# EAGLE design tut1 (EAGLE 6.5.0)
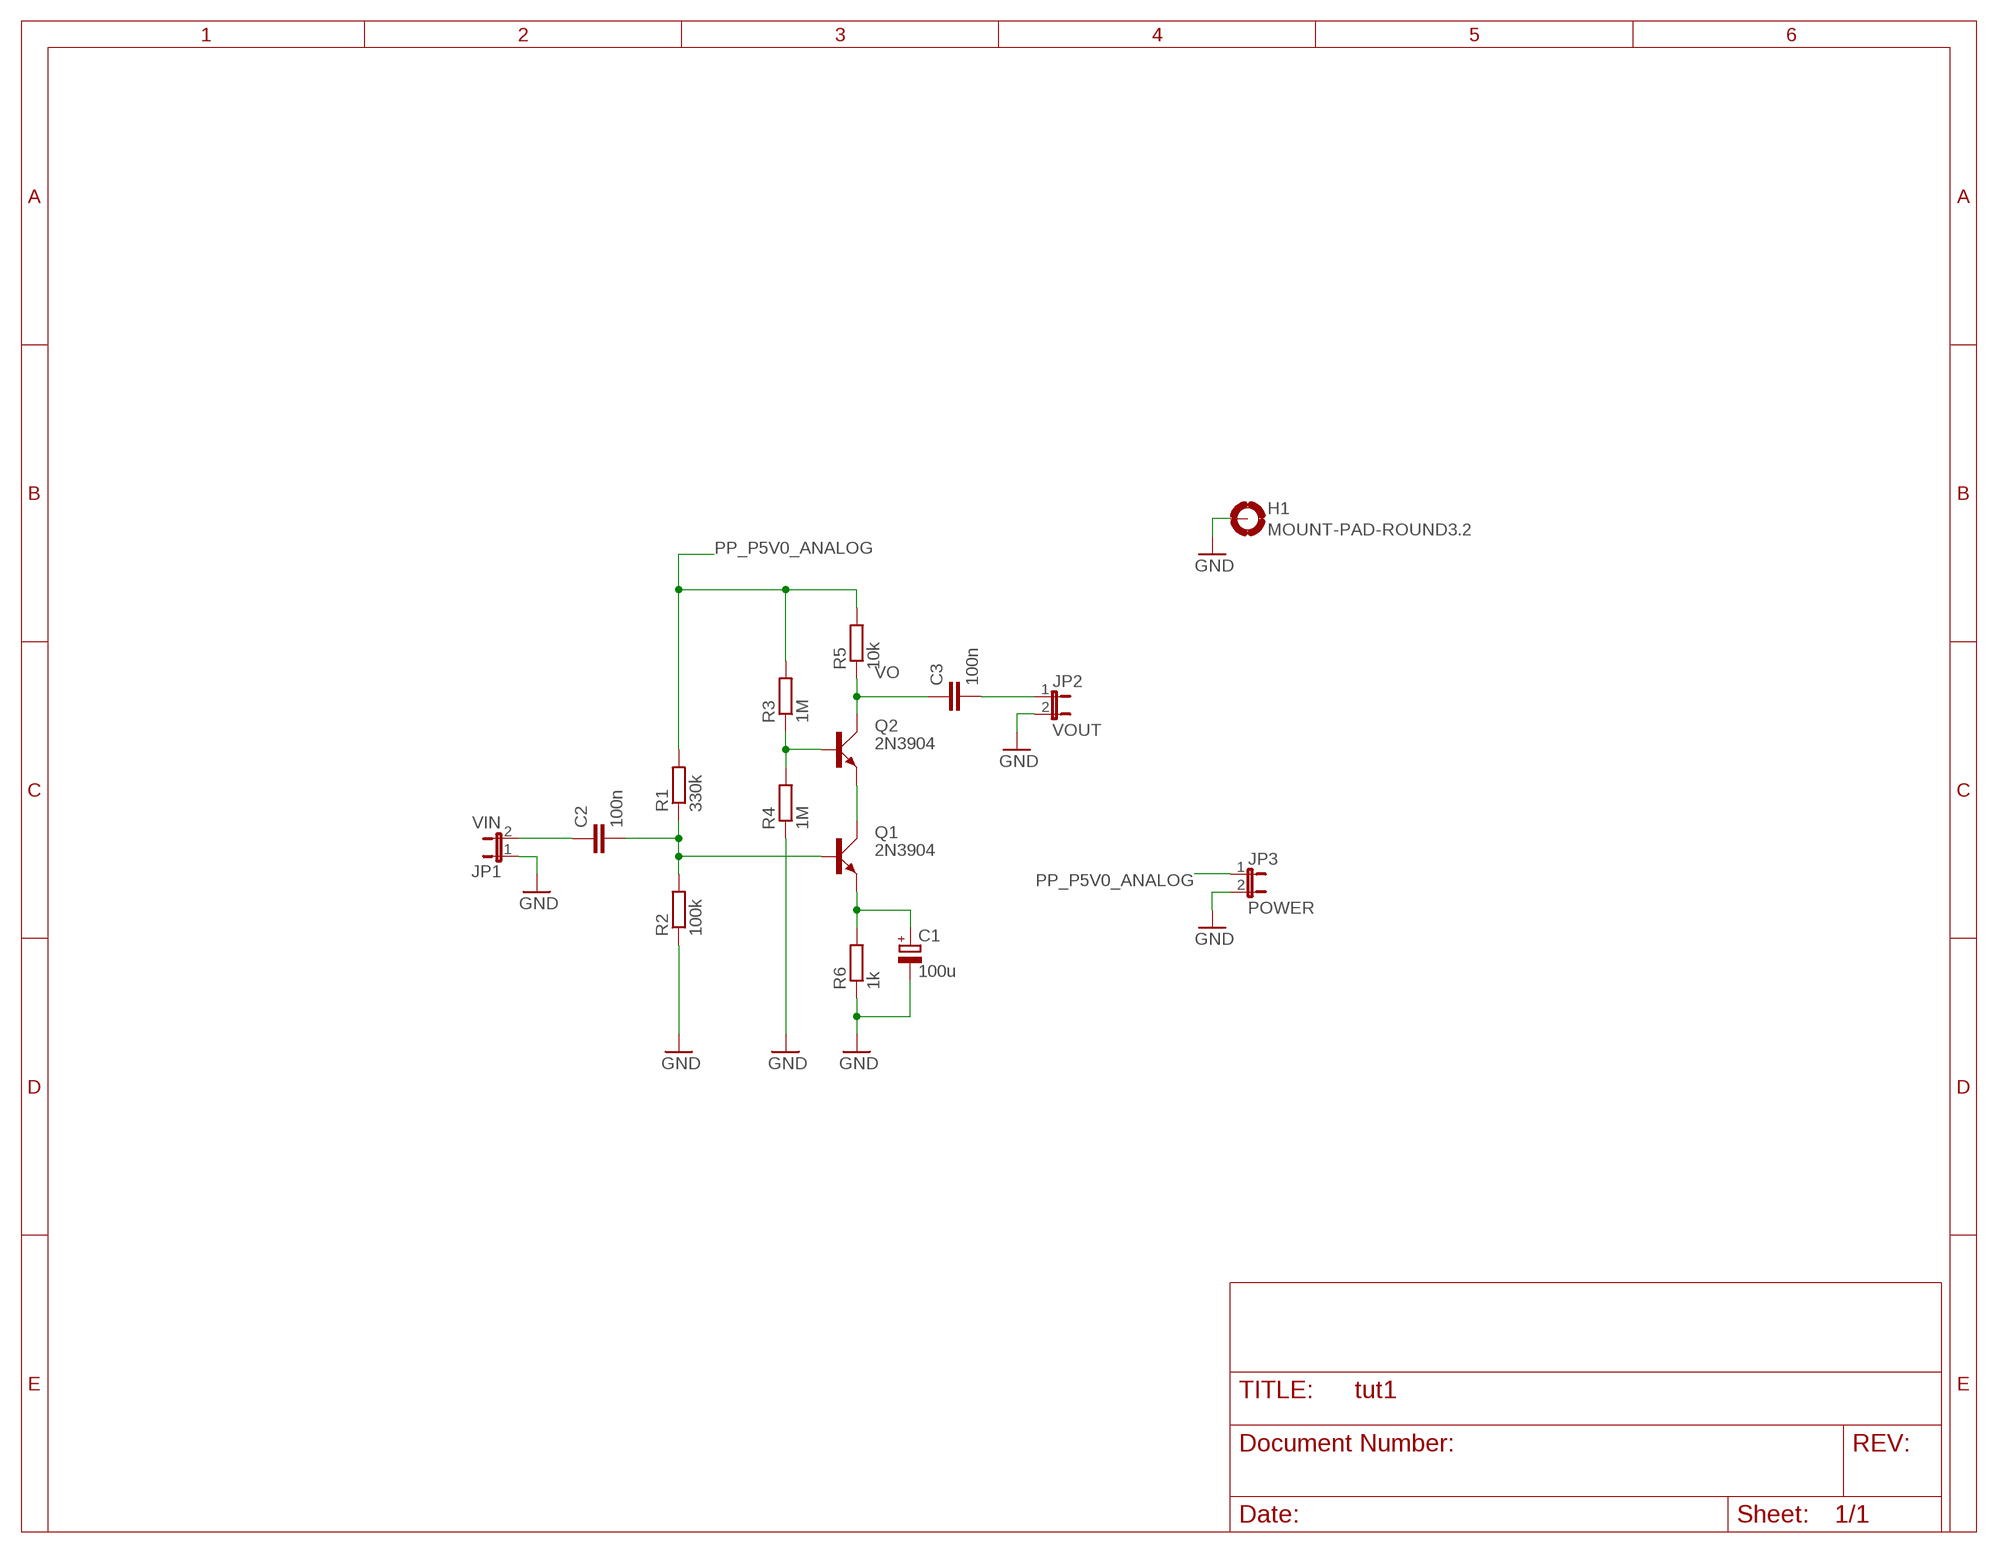
[diagram p0: schematic, sheet 1]

## Parts
C1  100u  CPOL-EUE5-10.5  [E5-10,5]
C2  100n  C-EU050-025X075  [C050-025X075]
C3  100n  C-EU050-025X075  [C050-025X075]
H1  MOUNT-PAD-ROUND3.2  [3,2-PAD]
JP1  VIN  JP1E  [JP1]
JP2  VOUT  JP1E  [JP1]
JP3  POWER  JP1E  [JP1]
Q1  2N3904  [TO92D]
Q2  2N3904  [TO92D]
R1  330k  R-EU_0207/10  [0207/10]
R2  100k  R-EU_0207/10  [0207/10]
R3  1M  R-EU_0207/10  [0207/10]
R4  1M  R-EU_0207/10  [0207/10]
R5  10k  R-EU_0207/10  [0207/10]
R6  1k  R-EU_0207/10  [0207/10]

## Nets
GND: C1.- H1.B3,2(MOUNT) JP1.1 JP2.2 JP3.2 R2.1 R4.1 R6.1
N$1: Q1.C Q2.E
N$2: C1.+ Q1.E R6.2
N$4: Q2.B R3.1 R4.2
N$6: C2.2 Q1.B R1.1 R2.2
N$12: C2.1 JP1.2
N$13: C3.2 JP2.1
PP_P5V0_ANALOG: JP3.1 R1.2 R3.2 R5.2
VO: C3.1 Q2.C R5.1

## Library data of the parts
C1 = rcl:CPOL-EU: POLARIZED CAPACITOR, European symbol
C2 C3 = rcl:C-EU: CAPACITOR, European symbol
H1 = holes:MOUNT-PAD-ROUND: MOUNTING PAD, round
JP1-JP3 = jumper:JP1E: JUMPER
Q1 Q2 = transistor-small-signal:2N3904: NPN TRANSISTOR
R1-R6 = rcl:R-EU_: RESISTOR, European symbol

## Net classes
0 default: width 0.813 mm

## Board
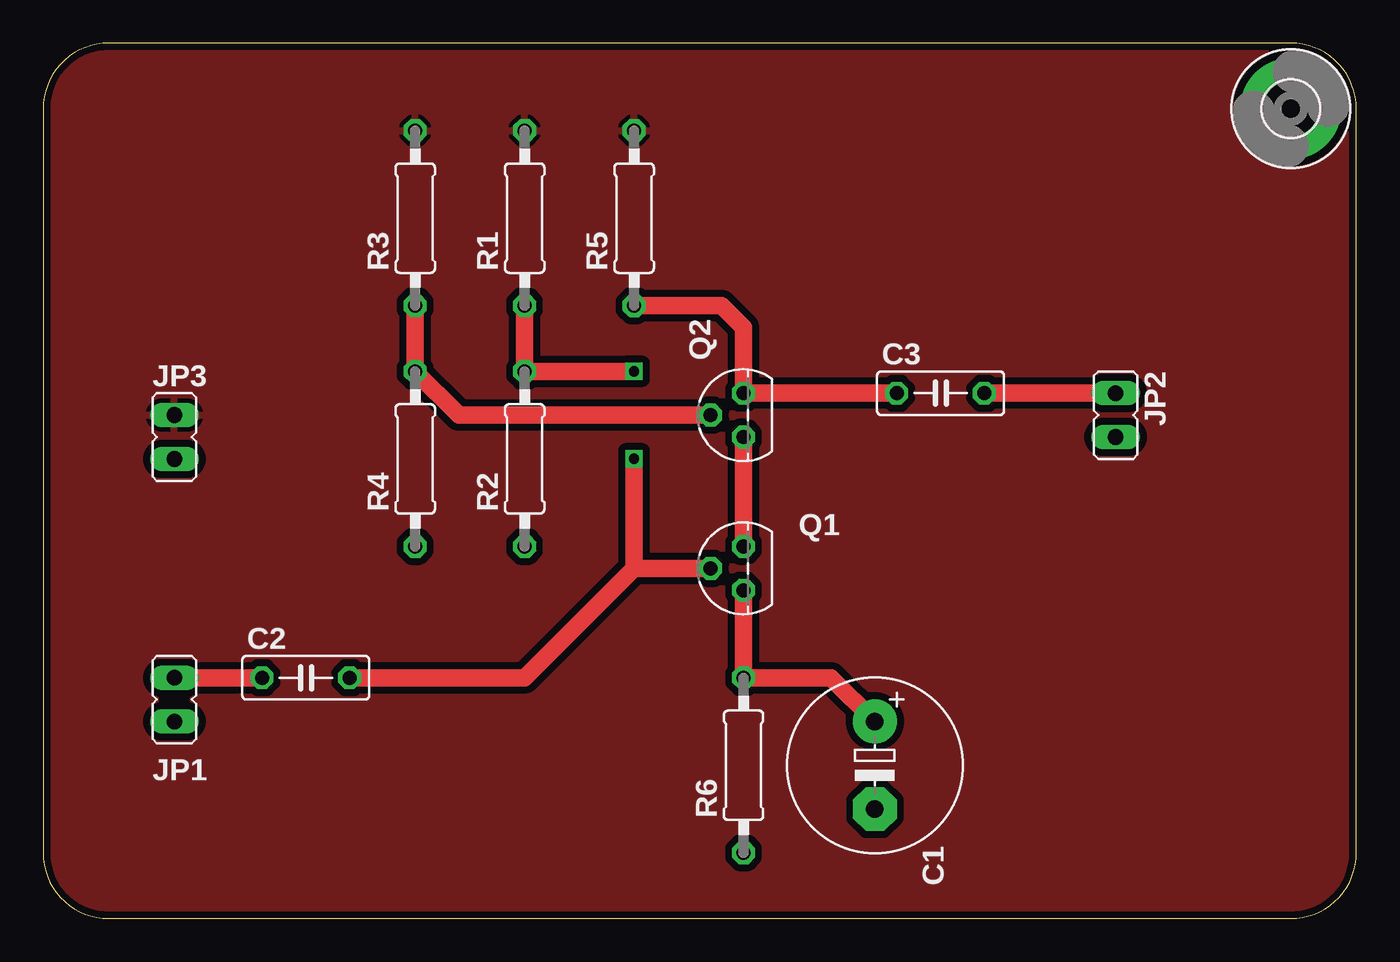
[diagram p1: board, top side]
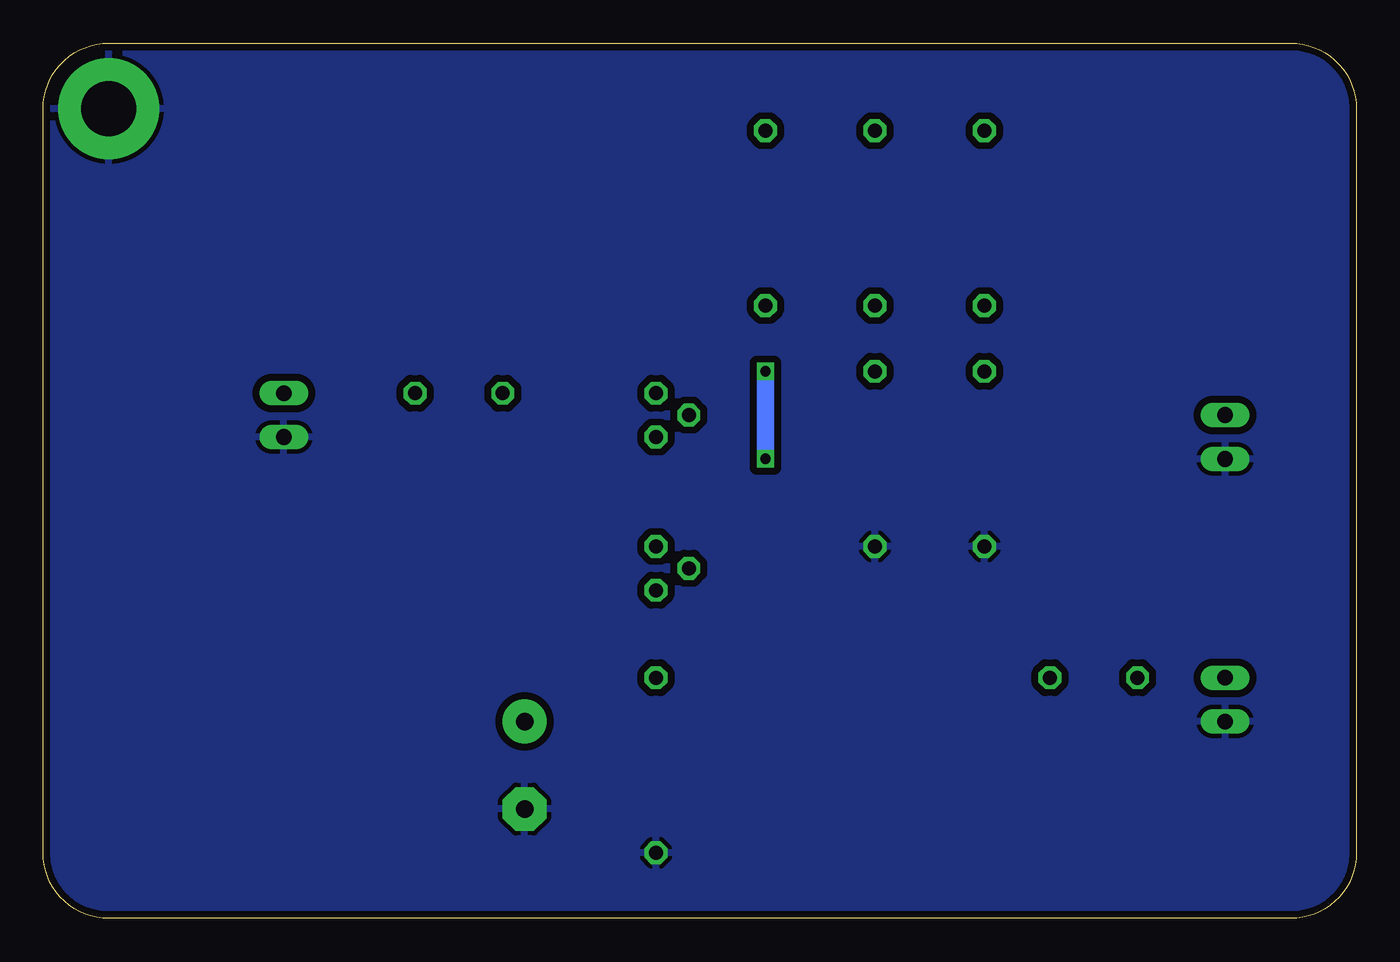
[diagram p2: board, bottom side, seen from below]

Size 76.2 x 50.8 mm. Coordinates in mm from the lower left corner, seen from the top.
Outline: 0,46.99 0,3.81 arc90 3.81,0 72.39,0 arc90 76.2,3.81 76.2,46.99 arc90 72.39,50.8 3.81,50.8 arc90 0,46.99
Copper layers (1*16): Top 0.035mm / dielectric 1.5mm / Bottom 0.035mm
Design rules "default *": minimum track width 16mil, minimum drill 24mil, track to track 16mil, track to pad 16mil, pad to pad 16mil, via to via 16mil, smd to smd 16mil, copper to edge 16mil, drill to drill 8mil, minimum pad ring 10mil, minimum via ring 8mil, stop-mask expansion 4mil, vias tented up to drill 0mil, thermal gap 10mil

### Footprints (pad centres in the part's own frame; a part is rotated, then mirrored left to right if it is on the bottom)
E5-10,5 = drill 1.016 pad 2.54: + -2.54,0 | drill 1.016 pad 2.54 octagon: - 2.54,0
C050-025X075 = drill 0.813 octagon: 1 -2.54,0; 2 2.54,0
3,2-PAD = drill 3.2 pad 5.842: B3,2 0,0
JP1 = drill 0.914 long: 1 0,-1.27; 2 0,1.27
TO92D = drill 0.813 octagon: B 0,1.905; C 1.27,0; E -1.27,0
0207/10 = drill 0.813 octagon: 1 -5.08,0; 2 5.08,0

### Placement (x,y rotation side)
C1  48.26,8.89 270 top
C2  15.24,13.97 0 top
C3  52.07,30.48 0 top
H1  72.39,46.99 0 top
JP1  7.62,12.7 0 top
JP2  62.23,29.21 180 top
JP3  7.62,27.94 180 top
Q1  40.64,20.32 90 top
Q2  40.64,29.21 90 top
R1  27.94,40.64 90 top
R2  27.94,26.67 90 top
R3  21.59,40.64 90 top
R4  21.59,26.67 90 top
R5  34.29,40.64 90 top
R6  40.64,8.89 90 top

### Tracks (layer width: path | path; a pad name or v marks a point on that pad's centre or on a via)
GND
  pour Bottom: 0,50.8 76.2,50.8 76.2,0 0,0
N$1
  Top 1.016: Q2.E Q1.C
N$2
  Top 1.016: Q1.E R6.2 45.72,13.97 C1.+
N$4
  Top 1.016: R3.1 R4.2 24.13,29.21 Q2.B
N$6  (via drill 0.6)
  Top 1.016: R1.1 R2.2 v34.29,31.75 | Q1.B 34.29,20.32 | 34.29,20.32 27.94,13.97 C2.2 | v34.29,26.67 34.29,20.32
  Bottom 1.016: v34.29,31.75 v34.29,26.67
N$12
  Top 1.016: JP1.2 C2.1
N$13
  Top 1.016: C3.2 JP2.1
PP_P5V0_ANALOG
  pour Top: 0,50.8 76.2,50.8 76.2,0 0,0
VO
  Top 1.016: R5.1 39.37,35.56 40.64,34.29 Q2.C C3.1